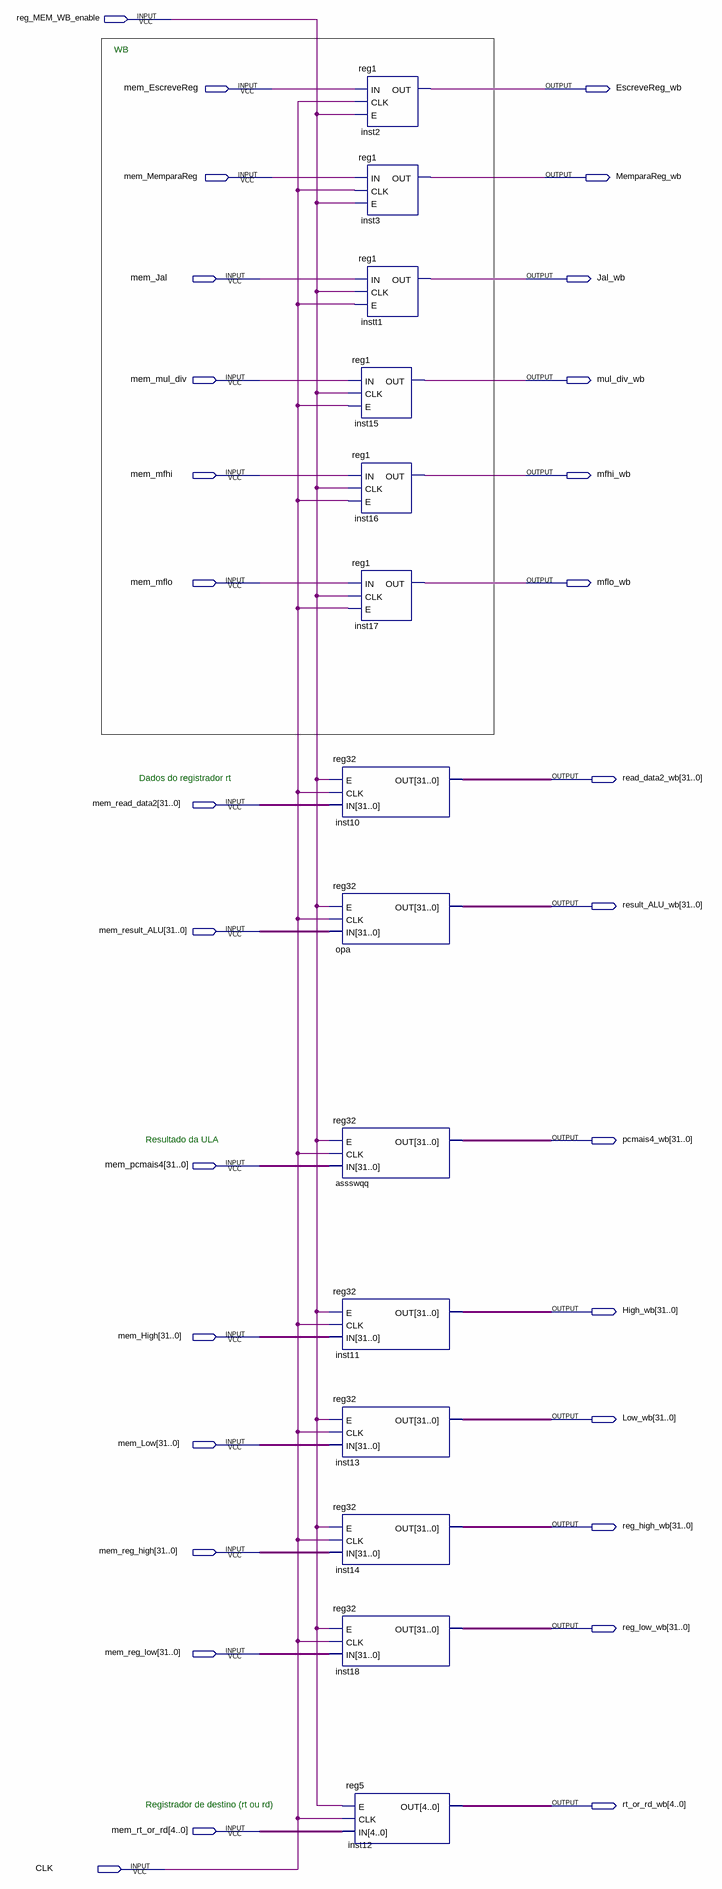
[diagram p0: schematic sheet]
// Quartus schematic reg_MEM-WB.bdf as structural Verilog: 14 symbols, 30 pins
module \reg_MEM-WB  (
  input  reg_MEM_WB_enable,
  input  mem_EscreveReg,
  input  mem_MemparaReg,
  input  mem_Jal,
  input  mem_mul_div,
  input  mem_mfhi,
  input  mem_mflo,
  input  [31:0] mem_read_data2,
  input  [31:0] mem_result_ALU,
  input  [31:0] mem_pcmais4,
  input  [31:0] mem_High,
  input  [31:0] mem_Low,
  input  [31:0] mem_reg_high,
  input  [31:0] mem_reg_low,
  input  [4:0] mem_rt_or_rd,
  input  CLK,
  output EscreveReg_wb,
  output MemparaReg_wb,
  output Jal_wb,
  output mul_div_wb,
  output mfhi_wb,
  output mflo_wb,
  output [31:0] read_data2_wb,
  output [31:0] result_ALU_wb,
  output [31:0] pcmais4_wb,
  output [31:0] High_wb,
  output [31:0] Low_wb,
  output [31:0] reg_high_wb,
  output [31:0] reg_low_wb,
  output [4:0] rt_or_rd_wb
);

  reg32 inst10 (.E(reg_MEM_WB_enable), .CLK(CLK), .IN(mem_read_data2), .OUT(read_data2_wb));
  reg32 opa (.E(reg_MEM_WB_enable), .CLK(CLK), .IN(mem_result_ALU), .OUT(result_ALU_wb));
  reg32 assswqq (.E(reg_MEM_WB_enable), .CLK(CLK), .IN(mem_pcmais4), .OUT(pcmais4_wb));
  reg32 inst11 (.E(reg_MEM_WB_enable), .CLK(CLK), .IN(mem_High), .OUT(High_wb));
  reg32 inst13 (.E(reg_MEM_WB_enable), .CLK(CLK), .IN(mem_Low), .OUT(Low_wb));
  reg32 inst14 (.E(reg_MEM_WB_enable), .CLK(CLK), .IN(mem_reg_high), .OUT(reg_high_wb));
  reg32 inst18 (.E(reg_MEM_WB_enable), .CLK(CLK), .IN(mem_reg_low), .OUT(reg_low_wb));
  reg5 inst12 (.E(reg_MEM_WB_enable), .CLK(CLK), .IN(mem_rt_or_rd), .OUT(rt_or_rd_wb));
  reg1 inst2 (.IN(mem_EscreveReg), .CLK(CLK), .E(reg_MEM_WB_enable), .OUT(EscreveReg_wb));
  reg1 inst3 (.IN(mem_MemparaReg), .CLK(CLK), .E(reg_MEM_WB_enable), .OUT(MemparaReg_wb));
  reg1 instt1 (.IN(mem_Jal), .CLK(reg_MEM_WB_enable), .E(CLK), .OUT(Jal_wb));
  reg1 inst15 (.IN(mem_mul_div), .CLK(reg_MEM_WB_enable), .E(CLK), .OUT(mul_div_wb));
  reg1 inst16 (.IN(mem_mfhi), .CLK(reg_MEM_WB_enable), .E(CLK), .OUT(mfhi_wb));
  reg1 inst17 (.IN(mem_mflo), .CLK(reg_MEM_WB_enable), .E(CLK), .OUT(mflo_wb));

  // Notes on the sheet:
  //   WB
  //   Dados do registrador rt
  //   Resultado da ULA
  //   Registrador de destino (rt ou rd)
endmodule
